# Altium project RbMotor_ECAT_RevB+.PrjPcb (part 2 of 2)

## Sheet 11.Current sampling.SchDoc
size 297 x 209 mm
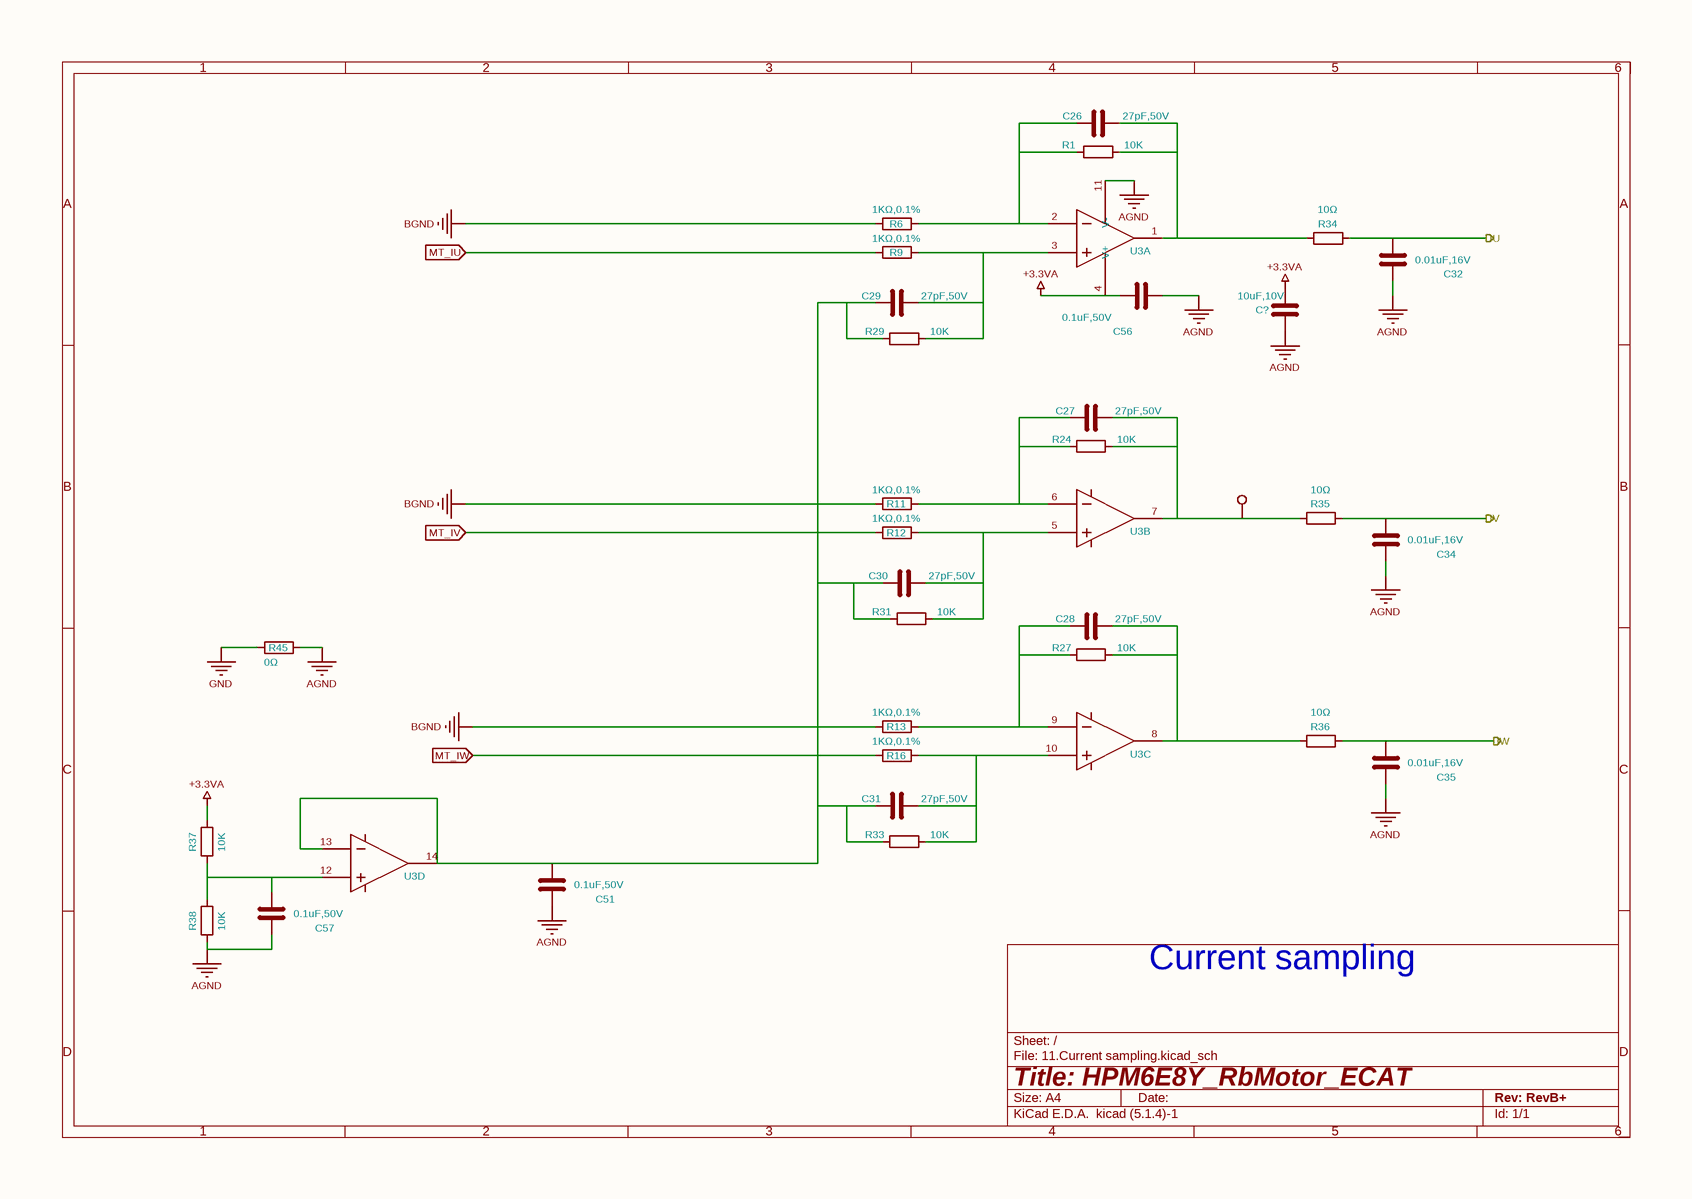
[diagram p12: 11.Current sampling.SchDoc]

### Parts
(Parts that share a designator on the sheet are numbered #1, #2 ... from top to bottom, then left to right.)
C26#2  27pF,50V  [C_0402]
C27  27pF,50V  [C_0402]
C28  27pF,50V  [C_0402]
C29  27pF,50V  [C_0402]
C30  27pF,50V  [C_0402]
C31  27pF,50V  [C_0402]
C32  0.01uF,16V  [C_0402_1005Metric]
C34  0.01uF,16V  [C_0402_1005Metric]
C35  0.01uF,16V  [C_0402_1005Metric]
C51  0.1uF,50V  [C_0402_1005Metric]
C56  0.1uF,50V  [C_0402_1005Metric]
C57  0.1uF,50V  [C_0402_1005Metric]
C?#9  10uF,10V  [C_0402]
R1  10K  [R_0402_1005Metric]
R6  1KΩ,0.1%  [R_0402_1005Metric]
R9  1KΩ,0.1%  [R_0402_1005Metric]
R11  1KΩ,0.1%  [R_0402_1005Metric]
R12  1KΩ,0.1%  [R_0402_1005Metric]
R13  1KΩ,0.1%  [R_0402_1005Metric]
R16  1KΩ,0.1%  [R_0402_1005Metric]
R24  10K  [R_0402_1005Metric]
R27  10K  [R_0402_1005Metric]
R29  10K  [R_0402_1005Metric]
R31  10K  [R_0402_1005Metric]
R33  10K  [R_0402_1005Metric]
R34  10Ω  [R_0402_1005Metric]
R35  10Ω  [R_0402_1005Metric]
R36  10Ω  [R_0402_1005Metric]
R37  10K  [R_0402_1005Metric]
R38  10K  [R_0402_1005Metric]
R45  0Ω  [R_0603_1608Metric]
TP14  0.5mm  [TestPoint_Pad_D0.5mm]  (value not drawn)
U3  TP2274-SR  [SOIC-14_L8.7-W3.9]  (value not drawn)  (parts A,B,C,D of 4)

### Ports
IU (out), IV (out), IW (out), MT_IU (in), MT_IV (in), MT_IW (in)

### Nets
+3.3VA: C56.2 C?#9.2 R37.2 U3.4(V+)
AGND: C32.2 C34.2 C35.2 C51.2 C56.1 C57.2 C?#9.1 R38.1 R45.1 U3.11(V-)
BGND: R6.1 R11.1 R13.1
GND: R45.2
IU: C32.1 R34.2 ; port IU
IV: C34.1 R35.2 ; port IV
IW: C35.1 R36.2 ; port IW
MT_IU: R9.1 ; port MT_IU
MT_IV: R12.1 ; port MT_IV
MT_IW: R16.1 ; port MT_IW
NetC26#2_1: C26#2.1 R1.1 R6.2 U3.2
NetC26#2_2: C26#2.2 R1.2 R34.1 U3.1
NetC27_1: C27.1 R11.2 R24.1 U3.6
NetC27_2: C27.2 R24.2 R35.1 TP14.1 U3.7
NetC28_1: C28.1 R13.2 R27.1 U3.9
NetC28_2: C28.2 R27.2 R36.1 U3.8
NetC29_1: C29.1 C30.1 C31.1 C51.1 R29.1 R31.1 R33.1 U3.13 U3.14
NetC29_2: C29.2 R9.2 R29.2 U3.3
NetC30_2: C30.2 R12.2 R31.2 U3.5
NetC31_2: C31.2 R16.2 R33.2 U3.10
NetC57_1: C57.1 R37.1 R38.2 U3.12

### Notes on the sheet
- Current sampling
- 1
- 2
- 3
- 4
- 5
- 6
- A
- B
- C
- D
- Title: HPM6E8Y_RbMotor_ECAT
- File: 11.Current sampling.kicad_sch
- Sheet: /
- KiCad E.D.A.  kicad (5.1.4)-1
- Size: A4
- Date:
- Rev: RevB+
- Id: 1/1

### Library data of the parts
C26#2 C27-C31 = 27pF,50V_0402: Model: 0402CG270J500NT; Company: FH(风华); Value: 27pF,50V; Footprint: 03_HPM_Capacitance:C_0402
C32 C34 C35 = 10nF,16V_0402: Model: CC0402KRX7R7BB103; Company: YAGEO(国巨); Value: 0.01uF,16V; Footprint: 03_HPM_Capacitance:C_0402_1005Metric
C51 C56 C57 = 0.1uF,50V_0402: Model: 0402B104K500NT; Company: SAMSUNG(三星); Value: 0.1uF,50V; Footprint: 03_HPM_Capacitance:C_0402_1005Metric
C?#9 = 10uF,10V_0402: as C9 on sheet 08.MCU_OSC; Value: 10uF,10V; Footprint: 03_HPM_Capacitance:C_0402
R1 R24 R27 R29 R31 R33 R37 R38 = 10K_0402: Model: 0402WGF1002TCE; Company: UNI-ROYAL(厚声); Value: 10K; Footprint: 02_HPM_Resistor:R_0402_1005Metric
R6 R9 R11-R13 R16 = 1K_0402: Company: UNI-ROYAL(厚声); Value: 1KΩ,0.1%; Footprint: 02_HPM_Resistor:R_0402_1005Metric
R34-R36 = 10Ω_0402: Model: 0402WGF100JTCE; Company: UNI-ROYAL(厚声); Value: 10Ω; Footprint: 02_HPM_Resistor:R_0402_1005Metric
R45 = 0Ω_0603: Model: 0603WAF0000T5E; Company: UNI-ROYAL(厚声); Value: 0Ω; Footprint: 02_HPM_Resistor:R_0603_1608Metric
TP14 = TestPoint-0.5mm: Value: 0.5mm; Footprint: 01_HPM_Peripheral:TestPoint_Pad_D0.5mm
U3 = TP2274-SR: Company: 3PEAK(思瑞浦); Model: TP2274-SR; Value: TP2274-SR; Footprint: 13_ower:SOIC-14_L8.7-W3.9

## Sheet 03.MCU_PA_JTAG.SchDoc
size 297 x 209 mm
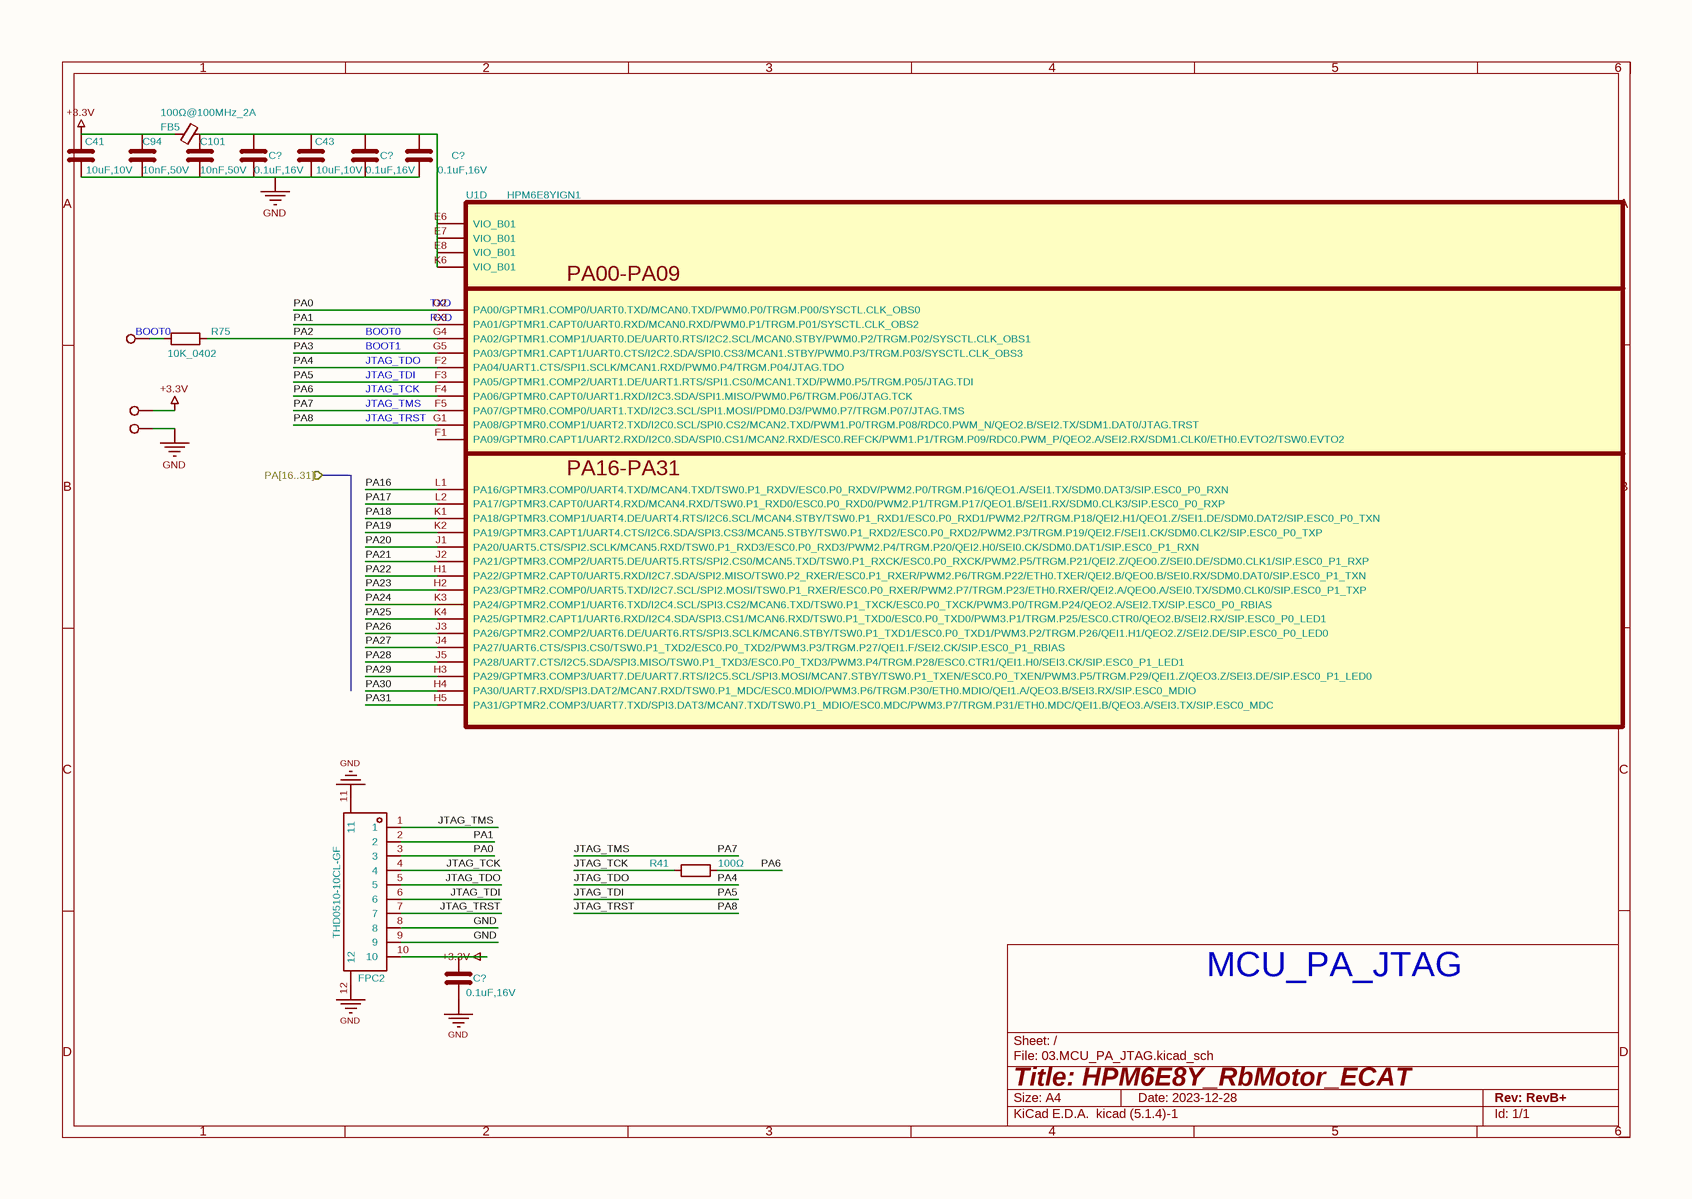
[diagram p13: 03.MCU_PA_JTAG.SchDoc]

### Parts
(Parts that share a designator on the sheet are numbered #1, #2 ... from top to bottom, then left to right.)
C41  10uF,10V  [C_0603_1608Metric]
C43  10uF,10V  [C_0603_1608Metric]
C94  10nF,50V  [C_0402_1005Metric]
C101  10nF,50V  [C_0402_1005Metric]
C?#10  0.1uF,16V  [C_0402]
C?#11  0.1uF,16V  [C_0402]
C?#12  0.1uF,16V  [C_0402]
C?#13  0.1uF,16V  [C_0402]
FB5  100Ω@100MHz_2A  [R_0603_1608Metric]
FPC2  THD0510-10CL-GF  [FPC_10P_0.5mm_JTAG]
R41  100Ω  [R_0402_1005Metric]
R75  10K_0402  [R_0402_1005Metric]
TP7  1.0mm  [TestPoint_1.5]  (value not drawn)
TP8  1.0mm  [TestPoint_1.5]  (value not drawn)
TP37  1.0mm  [TestPoint_1.5]  (value not drawn)
U1  HPM6E8YIGN1  [BGA-196_14x14_12.0x12.0mm_P0.8mm]  (part D of 10)

### Ports
PA[16..31] (in)

### Nets
+3.3V: C41.1 C94.1 C?#13.1 FB5.2 FPC2.10 TP8.1
GND: C41.2 C43.2 C94.2 C101.2 C?#10.2 C?#11.2 C?#12.2 C?#13.2 FPC2.8 FPC2.9 FPC2.11 FPC2.12 TP37.1
JTAG_TCK: FPC2.4 R41.1
JTAG_TDI: FPC2.6 U1.F3(PA05/GPTMR1.COMP2/UART1.DE/UART1.RTS/SPI1.CS0/MCAN1.TXD/PWM0.P5/TRGM.P05/JTAG.TDI)  [also labelled PA5]
JTAG_TDO: FPC2.5 U1.F2(PA04/UART1.CTS/SPI1.SCLK/MCAN1.RXD/PWM0.P4/TRGM.P04/JTAG.TDO)  [also labelled PA4]
JTAG_TMS: FPC2.1 U1.F5(PA07/GPTMR0.COMP0/UART1.TXD/I2C3.SCL/SPI1.MOSI/PDM0.D3/PWM0.P7/TRGM.P07/JTAG.TMS)  [also labelled PA7]
JTAG_TRST: FPC2.7 U1.G1(PA08/GPTMR0.COMP1/UART2.TXD/I2C0.SCL/SPI0.CS2/MCAN2.TXD/PWM1.P0/TRGM.P08/RDC0.PWM_N/QEO2.B/SEI2.TX/SDM1.DAT0/JTAG.TRST)  [also labelled PA8]
PA0: FPC2.3 U1.G2(PA00/GPTMR1.COMP0/UART0.TXD/MCAN0.TXD/PWM0.P0/TRGM.P00/SYSCTL.CLK_OBS0)
PA1: FPC2.2 U1.G3(PA01/GPTMR1.CAPT0/UART0.RXD/MCAN0.RXD/PWM0.P1/TRGM.P01/SYSCTL.CLK_OBS2)
PA2: R75.2 U1.G4(PA02/GPTMR1.COMP1/UART0.DE/UART0.RTS/I2C2.SCL/MCAN0.STBY/PWM0.P2/TRGM.P02/SYSCTL.CLK_OBS1)
PA3: U1.G5(PA03/GPTMR1.CAPT1/UART0.CTS/I2C2.SDA/SPI0.CS3/MCAN1.STBY/PWM0.P3/TRGM.P03/SYSCTL.CLK_OBS3)
PA6: R41.2 U1.F4(PA06/GPTMR0.CAPT0/UART1.RXD/I2C3.SDA/SPI1.MISO/PWM0.P6/TRGM.P06/JTAG.TCK)
PA16: U1.L1(PA16/GPTMR3.COMP0/UART4.TXD/MCAN4.TXD/TSW0.P1_RXDV/ESC0.P0_RXDV/PWM2.P0/TRGM.P16/QEO1.A/SEI1.TX/SDM0.DAT3/SIP.ESC0_P0_RXN)
PA17: U1.L2(PA17/GPTMR3.CAPT0/UART4.RXD/MCAN4.RXD/TSW0.P1_RXD0/ESC0.P0_RXD0/PWM2.P1/TRGM.P17/QEO1.B/SEI1.RX/SDM0.CLK3/SIP.ESC0_P0_RXP)
PA18: U1.K1(PA18/GPTMR3.COMP1/UART4.DE/UART4.RTS/I2C6.SCL/MCAN4.STBY/TSW0.P1_RXD1/ESC0.P0_RXD1/PWM2.P2/TRGM.P18/QEI2.H1/QEO1.Z/SEI1.DE/SDM0.DAT2/SIP.ESC0_P0_TXN)
PA19: U1.K2(PA19/GPTMR3.CAPT1/UART4.CTS/I2C6.SDA/SPI3.CS3/MCAN5.STBY/TSW0.P1_RXD2/ESC0.P0_RXD2/PWM2.P3/TRGM.P19/QEI2.F/SEI1.CK/SDM0.CLK2/SIP.ESC0_P0_TXP)
PA20: U1.J1(PA20/UART5.CTS/SPI2.SCLK/MCAN5.RXD/TSW0.P1_RXD3/ESC0.P0_RXD3/PWM2.P4/TRGM.P20/QEI2.H0/SEI0.CK/SDM0.DAT1/SIP.ESC0_P1_RXN)
PA21: U1.J2(PA21/GPTMR3.COMP2/UART5.DE/UART5.RTS/SPI2.CS0/MCAN5.TXD/TSW0.P1_RXCK/ESC0.P0_RXCK/PWM2.P5/TRGM.P21/QEI2.Z/QEO0.Z/SEI0.DE/SDM0.CLK1/SIP.ESC0_P1_RXP)
PA22: U1.H1(PA22/GPTMR2.CAPT0/UART5.RXD/I2C7.SDA/SPI2.MISO/TSW0.P2_RXER/ESC0.P1_RXER/PWM2.P6/TRGM.P22/ETH0.TXER/QEI2.B/QEO0.B/SEI0.RX/SDM0.DAT0/SIP.ESC0_P1_TXN)
PA23: U1.H2(PA23/GPTMR2.COMP0/UART5.TXD/I2C7.SCL/SPI2.MOSI/TSW0.P1_RXER/ESC0.P0_RXER/PWM2.P7/TRGM.P23/ETH0.RXER/QEI2.A/QEO0.A/SEI0.TX/SDM0.CLK0/SIP.ESC0_P1_TXP)
PA24: U1.K3(PA24/GPTMR2.COMP1/UART6.TXD/I2C4.SCL/SPI3.CS2/MCAN6.TXD/TSW0.P1_TXCK/ESC0.P0_TXCK/PWM3.P0/TRGM.P24/QEO2.A/SEI2.TX/SIP.ESC0_P0_RBIAS)
PA25: U1.K4(PA25/GPTMR2.CAPT1/UART6.RXD/I2C4.SDA/SPI3.CS1/MCAN6.RXD/TSW0.P1_TXD0/ESC0.P0_TXD0/PWM3.P1/TRGM.P25/ESC0.CTR0/QEO2.B/SEI2.RX/SIP.ESC0_P0_LED1)
PA26: U1.J3(PA26/GPTMR2.COMP2/UART6.DE/UART6.RTS/SPI3.SCLK/MCAN6.STBY/TSW0.P1_TXD1/ESC0.P0_TXD1/PWM3.P2/TRGM.P26/QEI1.H1/QEO2.Z/SEI2.DE/SIP.ESC0_P0_LED0)
PA27: U1.J4(PA27/UART6.CTS/SPI3.CS0/TSW0.P1_TXD2/ESC0.P0_TXD2/PWM3.P3/TRGM.P27/QEI1.F/SEI2.CK/SIP.ESC0_P1_RBIAS)
PA28: U1.J5(PA28/UART7.CTS/I2C5.SDA/SPI3.MISO/TSW0.P1_TXD3/ESC0.P0_TXD3/PWM3.P4/TRGM.P28/ESC0.CTR1/QEI1.H0/SEI3.CK/SIP.ESC0_P1_LED1)
PA29: U1.H3(PA29/GPTMR3.COMP3/UART7.DE/UART7.RTS/I2C5.SCL/SPI3.MOSI/MCAN7.STBY/TSW0.P1_TXEN/ESC0.P0_TXEN/PWM3.P5/TRGM.P29/QEI1.Z/QEO3.Z/SEI3.DE/SIP.ESC0_P1_LED0)
PA30: U1.H4(PA30/UART7.RXD/SPI3.DAT2/MCAN7.RXD/TSW0.P1_MDC/ESC0.MDIO/PWM3.P6/TRGM.P30/ETH0.MDIO/QEI1.A/QEO3.B/SEI3.RX/SIP.ESC0_MDIO)
PA31: U1.H5(PA31/GPTMR2.COMP3/UART7.TXD/SPI3.DAT3/MCAN7.TXD/TSW0.P1_MDIO/ESC0.MDC/PWM3.P7/TRGM.P31/ETH0.MDC/QEI1.B/QEO3.A/SEI3.TX/SIP.ESC0_MDC)
NetC43_1: C43.1 C101.1 C?#10.1 C?#11.1 C?#12.1 FB5.1 U1.E6(VIO_B01) U1.E7(VIO_B01) U1.E8(VIO_B01) U1.K6(VIO_B01)
NetR75_1: R75.1 TP7.1

Not connected (* = marked no-connect by the designer): U1 F1(PA09/GPTMR0.CAPT1/UART2.RXD/I2C0.SDA/SPI0.CS1/MCAN2.RXD/ESC0.REFCK/PWM1.P1/TRGM.P09/RDC0.PWM_P/QEO2.A/SEI2.RX/SDM1.CLK0/ETH0.EVTO2/TSW0.EVTO2)

### Notes on the sheet
- (near TP7) BOOT0
- BOOT1
- JTAG_TDO
- BOOT0
- (near U1) RXD
- (near U1) TXD
- (near U1) JTAG_TRST
- JTAG_TMS
- JTAG_TCK
- JTAG_TDI
- MCU_PA_JTAG
- 1
- 2
- 3
- 4
- 5
- 6
- A
- B
- C
- D
- Title: HPM6E8Y_RbMotor_ECAT
- File: 03.MCU_PA_JTAG.kicad_sch
- Sheet: /
- KiCad E.D.A.  kicad (5.1.4)-1
- Size: A4
- Date: 2023-12-28
- Rev: RevB+
- Id: 1/1
- (in symbol HPM6E8YIGN1, part D) PA00-PA09; PA16-PA31

### Library data of the parts
C41 C43 = 10uF,10V_0603: Model: CL10A106KP8NNNC; Company: SAMSUNG(三星); Value: 10uF,10V; Footprint: 03_HPM_Capacitance:C_0603_1608Metric
C94 C101 = 10nF,50V_0402: Model: CL05B103KB5NNNC; Company: SAMSUNG(三星); Value: 10nF,50V; Footprint: 03_HPM_Capacitance:C_0402_1005Metric
C?#10-C?#13 = 0.1uF,16V_0402: Model: CL05B104KO5NNNC; Company: SAMSUNG(三星); Value: 0.1uF,16V; Footprint: 03_HPM_Capacitance:C_0402
FB5 = 磁珠-100Ω@100MHz_2A_0603: Model: PZ1608D101-2R0TF; Company: Sunlord(顺络); Value: 100Ω@100MHz_2A; Footprint: 02_HPM_Resistor:R_0603_1608Metric
FPC2 = FPC_10P_0.5MM_JTAG: Company: THD(台华达); Model: THD0510-10CL-GF; Value: THD0510-10CL-GF; Footprint: 13_ower:FPC_10P_0.5mm_JTAG
R41 = 100Ω_0402: Model: 0402WGF1000TCE; Company: UNI-ROYAL(厚声); Value: 100Ω; Footprint: 02_HPM_Resistor:R_0402_1005Metric
R75 = 10K_0402: as R1 on sheet 11.Current sampling; Value: 10K_0402; Footprint: 02_HPM_Resistor:R_0402_1005Metric
TP7 TP8 TP37 = TestPoint-1.0mm: Value: 1.0mm; Footprint: 01_HPM_Peripheral:TestPoint_1.5
U1 = HPM6E8YIGN1: Value: HPM6E8YIGN1; Footprint: 00_HPM_Library:BGA-196_14x14_12.0x12.0mm_P0.8mm

## Sheet 06.MCU_PD.SchDoc
size 297 x 209 mm
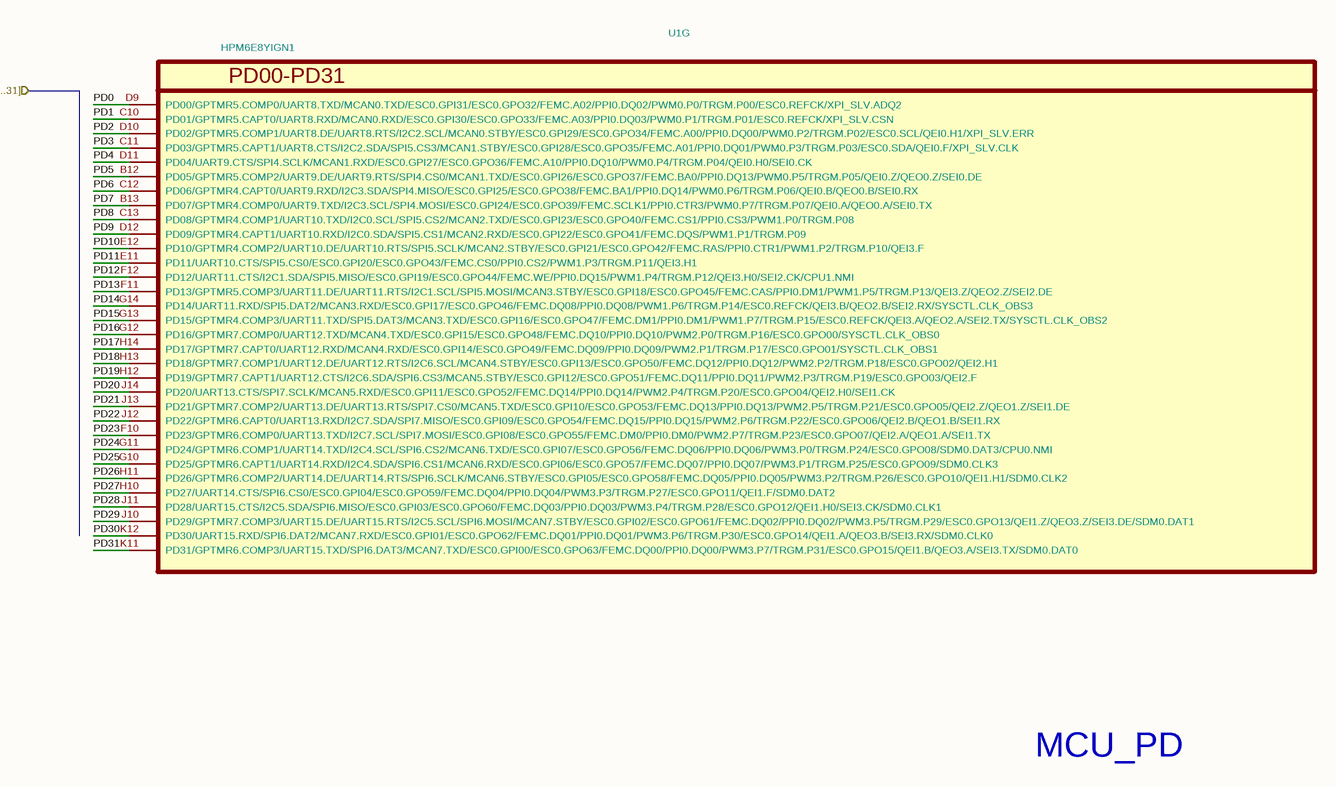
[diagram p14: 06.MCU_PD.SchDoc]

### Parts
U1  HPM6E8YIGN1  [BGA-196_14x14_12.0x12.0mm_P0.8mm]  (part G of 10)

### Ports
PD[0..31] (in)

### Nets
PD0: U1.D9(PD00/GPTMR5.COMP0/UART8.TXD/MCAN0.TXD/ESC0.GPI31/ESC0.GPO32/FEMC.A02/PPI0.DQ02/PWM0.P0/TRGM.P00/ESC0.REFCK/XPI_SLV.ADQ2)
PD1: U1.C10(PD01/GPTMR5.CAPT0/UART8.RXD/MCAN0.RXD/ESC0.GPI30/ESC0.GPO33/FEMC.A03/PPI0.DQ03/PWM0.P1/TRGM.P01/ESC0.REFCK/XPI_SLV.CSN)
PD2: U1.D10(PD02/GPTMR5.COMP1/UART8.DE/UART8.RTS/I2C2.SCL/MCAN0.STBY/ESC0.GPI29/ESC0.GPO34/FEMC.A00/PPI0.DQ00/PWM0.P2/TRGM.P02/ESC0.SCL/QEI0.H1/XPI_SLV.ERR)
PD3: U1.C11(PD03/GPTMR5.CAPT1/UART8.CTS/I2C2.SDA/SPI5.CS3/MCAN1.STBY/ESC0.GPI28/ESC0.GPO35/FEMC.A01/PPI0.DQ01/PWM0.P3/TRGM.P03/ESC0.SDA/QEI0.F/XPI_SLV.CLK)
PD4: U1.D11(PD04/UART9.CTS/SPI4.SCLK/MCAN1.RXD/ESC0.GPI27/ESC0.GPO36/FEMC.A10/PPI0.DQ10/PWM0.P4/TRGM.P04/QEI0.H0/SEI0.CK)
PD5: U1.B12(PD05/GPTMR5.COMP2/UART9.DE/UART9.RTS/SPI4.CS0/MCAN1.TXD/ESC0.GPI26/ESC0.GPO37/FEMC.BA0/PPI0.DQ13/PWM0.P5/TRGM.P05/QEI0.Z/QEO0.Z/SEI0.DE)
PD6: U1.C12(PD06/GPTMR4.CAPT0/UART9.RXD/I2C3.SDA/SPI4.MISO/ESC0.GPI25/ESC0.GPO38/FEMC.BA1/PPI0.DQ14/PWM0.P6/TRGM.P06/QEI0.B/QEO0.B/SEI0.RX)
PD7: U1.B13(PD07/GPTMR4.COMP0/UART9.TXD/I2C3.SCL/SPI4.MOSI/ESC0.GPI24/ESC0.GPO39/FEMC.SCLK1/PPI0.CTR3/PWM0.P7/TRGM.P07/QEI0.A/QEO0.A/SEI0.TX)
PD8: U1.C13(PD08/GPTMR4.COMP1/UART10.TXD/I2C0.SCL/SPI5.CS2/MCAN2.TXD/ESC0.GPI23/ESC0.GPO40/FEMC.CS1/PPI0.CS3/PWM1.P0/TRGM.P08)
PD9: U1.D12(PD09/GPTMR4.CAPT1/UART10.RXD/I2C0.SDA/SPI5.CS1/MCAN2.RXD/ESC0.GPI22/ESC0.GPO41/FEMC.DQS/PWM1.P1/TRGM.P09)
PD10: U1.E12(PD10/GPTMR4.COMP2/UART10.DE/UART10.RTS/SPI5.SCLK/MCAN2.STBY/ESC0.GPI21/ESC0.GPO42/FEMC.RAS/PPI0.CTR1/PWM1.P2/TRGM.P10/QEI3.F)
PD11: U1.E11(PD11/UART10.CTS/SPI5.CS0/ESC0.GPI20/ESC0.GPO43/FEMC.CS0/PPI0.CS2/PWM1.P3/TRGM.P11/QEI3.H1)
PD12: U1.F12(PD12/UART11.CTS/I2C1.SDA/SPI5.MISO/ESC0.GPI19/ESC0.GPO44/FEMC.WE/PPI0.DQ15/PWM1.P4/TRGM.P12/QEI3.H0/SEI2.CK/CPU1.NMI)
PD13: U1.F11(PD13/GPTMR5.COMP3/UART11.DE/UART11.RTS/I2C1.SCL/SPI5.MOSI/MCAN3.STBY/ESC0.GPI18/ESC0.GPO45/FEMC.CAS/PPI0.DM1/PWM1.P5/TRGM.P13/QEI3.Z/QEO2.Z/SEI2.DE)
PD14: U1.G14(PD14/UART11.RXD/SPI5.DAT2/MCAN3.RXD/ESC0.GPI17/ESC0.GPO46/FEMC.DQ08/PPI0.DQ08/PWM1.P6/TRGM.P14/ESC0.REFCK/QEI3.B/QEO2.B/SEI2.RX/SYSCTL.CLK_OBS3)
PD15: U1.G13(PD15/GPTMR4.COMP3/UART11.TXD/SPI5.DAT3/MCAN3.TXD/ESC0.GPI16/ESC0.GPO47/FEMC.DM1/PPI0.DM1/PWM1.P7/TRGM.P15/ESC0.REFCK/QEI3.A/QEO2.A/SEI2.TX/SYSCTL.CLK_OBS2)
PD16: U1.G12(PD16/GPTMR7.COMP0/UART12.TXD/MCAN4.TXD/ESC0.GPI15/ESC0.GPO48/FEMC.DQ10/PPI0.DQ10/PWM2.P0/TRGM.P16/ESC0.GPO00/SYSCTL.CLK_OBS0)
PD17: U1.H14(PD17/GPTMR7.CAPT0/UART12.RXD/MCAN4.RXD/ESC0.GPI14/ESC0.GPO49/FEMC.DQ09/PPI0.DQ09/PWM2.P1/TRGM.P17/ESC0.GPO01/SYSCTL.CLK_OBS1)
PD18: U1.H13(PD18/GPTMR7.COMP1/UART12.DE/UART12.RTS/I2C6.SCL/MCAN4.STBY/ESC0.GPI13/ESC0.GPO50/FEMC.DQ12/PPI0.DQ12/PWM2.P2/TRGM.P18/ESC0.GPO02/QEI2.H1)
PD19: U1.H12(PD19/GPTMR7.CAPT1/UART12.CTS/I2C6.SDA/SPI6.CS3/MCAN5.STBY/ESC0.GPI12/ESC0.GPO51/FEMC.DQ11/PPI0.DQ11/PWM2.P3/TRGM.P19/ESC0.GPO03/QEI2.F)
PD20: U1.J14(PD20/UART13.CTS/SPI7.SCLK/MCAN5.RXD/ESC0.GPI11/ESC0.GPO52/FEMC.DQ14/PPI0.DQ14/PWM2.P4/TRGM.P20/ESC0.GPO04/QEI2.H0/SEI1.CK)
PD21: U1.J13(PD21/GPTMR7.COMP2/UART13.DE/UART13.RTS/SPI7.CS0/MCAN5.TXD/ESC0.GPI10/ESC0.GPO53/FEMC.DQ13/PPI0.DQ13/PWM2.P5/TRGM.P21/ESC0.GPO05/QEI2.Z/QEO1.Z/SEI1.DE)
PD22: U1.J12(PD22/GPTMR6.CAPT0/UART13.RXD/I2C7.SDA/SPI7.MISO/ESC0.GPI09/ESC0.GPO54/FEMC.DQ15/PPI0.DQ15/PWM2.P6/TRGM.P22/ESC0.GPO06/QEI2.B/QEO1.B/SEI1.RX)
PD23: U1.F10(PD23/GPTMR6.COMP0/UART13.TXD/I2C7.SCL/SPI7.MOSI/ESC0.GPI08/ESC0.GPO55/FEMC.DM0/PPI0.DM0/PWM2.P7/TRGM.P23/ESC0.GPO07/QEI2.A/QEO1.A/SEI1.TX)
PD24: U1.G11(PD24/GPTMR6.COMP1/UART14.TXD/I2C4.SCL/SPI6.CS2/MCAN6.TXD/ESC0.GPI07/ESC0.GPO56/FEMC.DQ06/PPI0.DQ06/PWM3.P0/TRGM.P24/ESC0.GPO08/SDM0.DAT3/CPU0.NMI)
PD25: U1.G10(PD25/GPTMR6.CAPT1/UART14.RXD/I2C4.SDA/SPI6.CS1/MCAN6.RXD/ESC0.GPI06/ESC0.GPO57/FEMC.DQ07/PPI0.DQ07/PWM3.P1/TRGM.P25/ESC0.GPO09/SDM0.CLK3)
PD26: U1.H11(PD26/GPTMR6.COMP2/UART14.DE/UART14.RTS/SPI6.SCLK/MCAN6.STBY/ESC0.GPI05/ESC0.GPO58/FEMC.DQ05/PPI0.DQ05/PWM3.P2/TRGM.P26/ESC0.GPO10/QEI1.H1/SDM0.CLK2)
PD27: U1.H10(PD27/UART14.CTS/SPI6.CS0/ESC0.GPI04/ESC0.GPO59/FEMC.DQ04/PPI0.DQ04/PWM3.P3/TRGM.P27/ESC0.GPO11/QEI1.F/SDM0.DAT2)
PD28: U1.J11(PD28/UART15.CTS/I2C5.SDA/SPI6.MISO/ESC0.GPI03/ESC0.GPO60/FEMC.DQ03/PPI0.DQ03/PWM3.P4/TRGM.P28/ESC0.GPO12/QEI1.H0/SEI3.CK/SDM0.CLK1)
PD29: U1.J10(PD29/GPTMR7.COMP3/UART15.DE/UART15.RTS/I2C5.SCL/SPI6.MOSI/MCAN7.STBY/ESC0.GPI02/ESC0.GPO61/FEMC.DQ02/PPI0.DQ02/PWM3.P5/TRGM.P29/ESC0.GPO13/QEI1.Z/QEO3.Z/SEI3.DE/SDM0.DAT1)
PD30: U1.K12(PD30/UART15.RXD/SPI6.DAT2/MCAN7.RXD/ESC0.GPI01/ESC0.GPO62/FEMC.DQ01/PPI0.DQ01/PWM3.P6/TRGM.P30/ESC0.GPO14/QEI1.A/QEO3.B/SEI3.RX/SDM0.CLK0)
PD31: U1.K11(PD31/GPTMR6.COMP3/UART15.TXD/SPI6.DAT3/MCAN7.TXD/ESC0.GPI00/ESC0.GPO63/FEMC.DQ00/PPI0.DQ00/PWM3.P7/TRGM.P31/ESC0.GPO15/QEI1.B/QEO3.A/SEI3.TX/SDM0.DAT0)

### Notes on the sheet
- MCU_PD
- 1
- 2
- 3
- 4
- 5
- 6
- A
- B
- C
- D
- Title: HPM6E8Y_RbMotor_ECAT
- File: 06.MCU_PD.kicad_sch
- Sheet: /
- KiCad E.D.A.  kicad (5.1.4)-1
- Size: A4
- Date:
- Rev: RevB+
- Id: 1/1
- (in symbol HPM6E8YIGN1, part G) PD00-PD31

### Library data of the parts
U1 = HPM6E8YIGN1: Value: HPM6E8YIGN1; Footprint: 00_HPM_Library:BGA-196_14x14_12.0x12.0mm_P0.8mm

## Sheet 02.MCU_POWER.SchDoc
size 297 x 209 mm
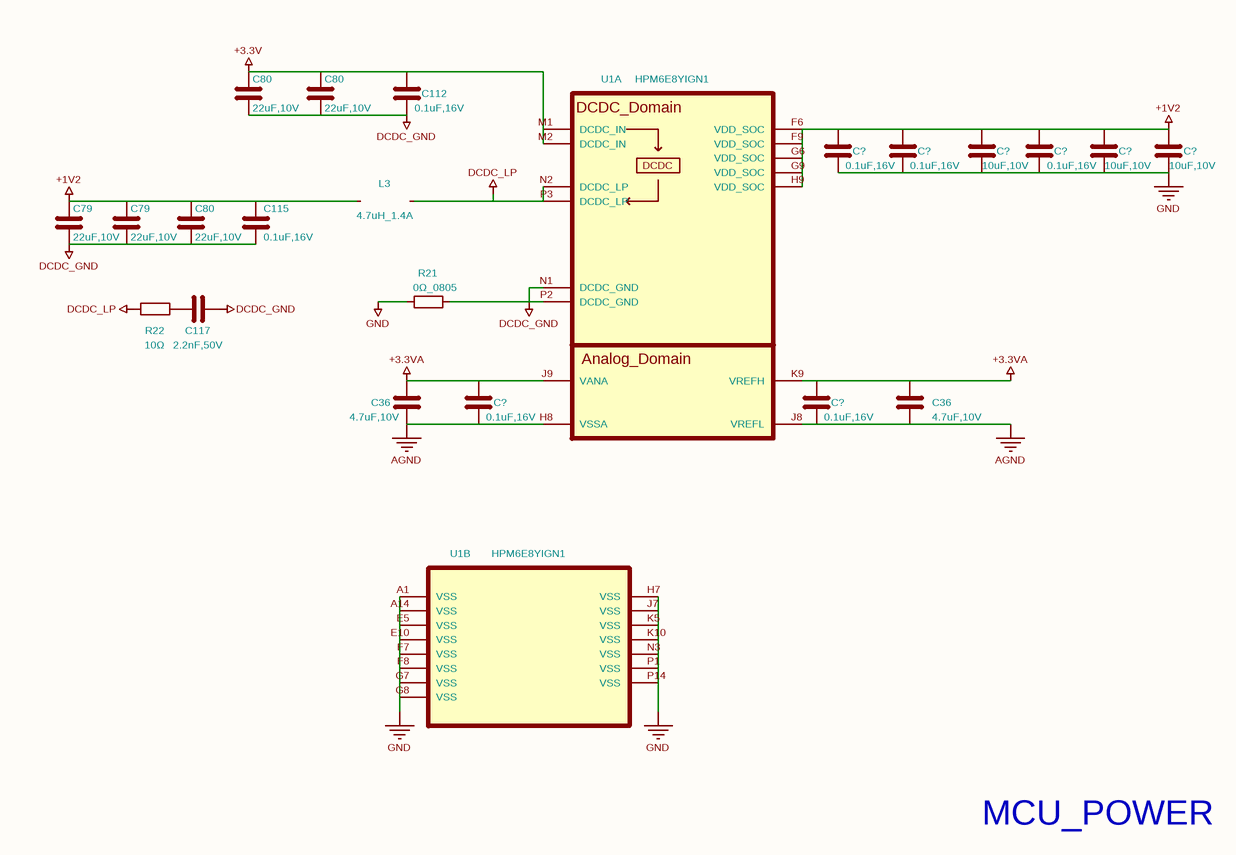
[diagram p15: 02.MCU_POWER.SchDoc]

### Parts
(Parts that share a designator on the sheet are numbered #1, #2 ... from top to bottom, then left to right.)
C36#2  4.7uF,10V  [C_0402]
C36#3  4.7uF,10V  [C_0402]
C79#2  22uF,10V  [C_0603_1608Metric]
C79#3  22uF,10V  [C_0603_1608Metric]
C80#2  22uF,10V  [C_0603_1608Metric]
C80#3  22uF,10V  [C_0603_1608Metric]
C80#4  22uF,10V  [C_0603_1608Metric]
C112  0.1uF,16V  [C_0402]
C115  0.1uF,16V  [C_0402]
C117  2.2nF,50V  [C_0402_1005Metric]
C?#14  0.1uF,16V  [C_0402]
C?#15  0.1uF,16V  [C_0402]
C?#16  10uF,10V  [C_0402]
C?#17  0.1uF,16V  [C_0402]
C?#18  10uF,10V  [C_0402]
C?#19  10uF,10V  [C_0402]
C?#20  0.1uF,16V  [C_0402]
C?#21  0.1uF,16V  [C_0402]
L3#2  4.7uH_1.4A  [L252010]
R21  0Ω_0805  [R_0805_2012Metric]
R22  10Ω  [R_0402_1005Metric]
U1  HPM6E8YIGN1  [BGA-196_14x14_12.0x12.0mm_P0.8mm]  (parts A,B of 10)

### Nets
+1V2: C79#2.1 C79#3.1 C80#4.1 C115.1 C?#14.1 C?#15.1 C?#16.1 C?#17.1 C?#18.1 C?#19.1 L3#2.1 U1.F6(VDD_SOC) U1.F9(VDD_SOC) U1.G6(VDD_SOC) U1.G9(VDD_SOC) U1.H9(VDD_SOC)
+3.3V: C80#2.1 C80#3.1 C112.1 U1.M1(DCDC_IN) U1.M2(DCDC_IN)
+3.3VA: C36#2.1 C36#3.1 C?#20.1 C?#21.1 U1.J9(VANA) U1.K9(VREFH)
AGND: C36#2.2 C36#3.2 C?#20.2 C?#21.2 U1.H8(VSSA) U1.J8(VREFL)
DCDC_GND: C79#2.2 C79#3.2 C80#2.2 C80#3.2 C80#4.2 C112.2 C115.2 C117.2 R21.2 U1.N1(DCDC_GND) U1.P2(DCDC_GND)
DCDC_LP: L3#2.2 R22.1 U1.N2(DCDC_LP) U1.P3(DCDC_LP)
GND: C?#14.2 C?#15.2 C?#16.2 C?#17.2 C?#18.2 C?#19.2 R21.1 U1.A1(VSS) U1.A14(VSS) U1.E5(VSS) U1.E10(VSS) U1.F7(VSS) U1.F8(VSS) U1.G7(VSS) U1.G8(VSS) U1.H7(VSS) U1.J7(VSS) U1.K5(VSS) U1.K10(VSS) U1.N3(VSS) U1.P1(VSS) U1.P14(VSS)
NetC117_1: C117.1 R22.2

### Notes on the sheet
- MCU_POWER
- 1
- 2
- 3
- 4
- 5
- 6
- A
- B
- C
- D
- Title: HPM6E8Y_RbMotor_ECAT
- File: 02.MCU_POWER.kicad_sch
- Sheet: /
- KiCad E.D.A.  kicad (5.1.4)-1
- Size: A4
- Date: 2023-12-28
- Rev: RevB+
- Id: 1/1
- (in symbol HPM6E8YIGN1, part A) DCDC_Domain; DCDC; Analog_Domain

### Library data of the parts
C36#2 C36#3 = 4.7uF,10V_0402: Model: CL05A475MP5NRNC; Company: SAMSUNG(三星); Value: 4.7uF,10V; Footprint: 03_HPM_Capacitance:C_0402
C79#2 C79#3 C80#2-C80#4 = 22uF,10V_0603: Model: CL10A226MP8NUNE; Company: SAMSUNG(三星); Value: 22uF,10V; Footprint: 03_HPM_Capacitance:C_0603_1608Metric
C112 = 0.1uF,16V_0402_6: Model: CL05B104KO5NNNC; Company: SAMSUNG(三星); Value: 0.1uF,16V; Footprint: 03_HPM_Capacitance:C_0402
C115 = 0.1uF,16V_0402_8: Model: CL05B104KO5NNNC; Company: SAMSUNG(三星); Value: 0.1uF,16V; Footprint: 03_HPM_Capacitance:C_0402
C117 = 2.2nF,50V_0402: Model: CL05B222KB5NNNC; Company: SAMSUNG(三星); Value: 2.2nF,50V; Footprint: 03_HPM_Capacitance:C_0402_1005Metric
C?#14 = 0.1uF,16V_0402_7: Model: CL05B104KO5NNNC; Company: SAMSUNG(三星); Value: 0.1uF,16V; Footprint: 03_HPM_Capacitance:C_0402
C?#15 = 0.1uF,16V_0402_17: Model: CL05B104KO5NNNC; Company: SAMSUNG(三星); Value: 0.1uF,16V; Footprint: 03_HPM_Capacitance:C_0402
C?#16 C?#18 C?#19 = 10uF,10V_0402: Model: CL05A106MP5NUNC; Company: SAMSUNG(三星); Value: 10uF,10V; Footprint: 03_HPM_Capacitance:C_0402
C?#17 = 0.1uF,16V_0402_5: Model: CL05B104KO5NNNC; Company: SAMSUNG(三星); Value: 0.1uF,16V; Footprint: 03_HPM_Capacitance:C_0402
C?#20 = 0.1uF,16V_0402_3: Model: CL05B104KO5NNNC; Company: SAMSUNG(三星); Value: 0.1uF,16V; Footprint: 03_HPM_Capacitance:C_0402
C?#21 = 0.1uF,16V_0402_1: Model: CL05B104KO5NNNC; Company: SAMSUNG(三星); Value: 0.1uF,16V; Footprint: 03_HPM_Capacitance:C_0402
L3#2 = 4.7uH_1.4A: Model: DFE252010F-4R7M; Company: muRata(村田); Value: 4.7uH_1.4A; Footprint: 07_HPM_Inductance:L252010
R21 = 0Ω_0805: Model: RS-05000JT; Company: FH(风华); Value: 0Ω_0805; Footprint: 02_HPM_Resistor:R_0805_2012Metric
R22 = 10Ω_0402: Model: 0402WGF100JTCE; Company: UNI-ROYAL(厚声); Value: 10Ω; Footprint: 02_HPM_Resistor:R_0402_1005Metric
U1 = HPM6E8YIGN1: Value: HPM6E8YIGN1; Footprint: 00_HPM_Library:BGA-196_14x14_12.0x12.0mm_P0.8mm

## Sheet 09.ECAT_IN_OUT.SchDoc
size 297 x 209 mm
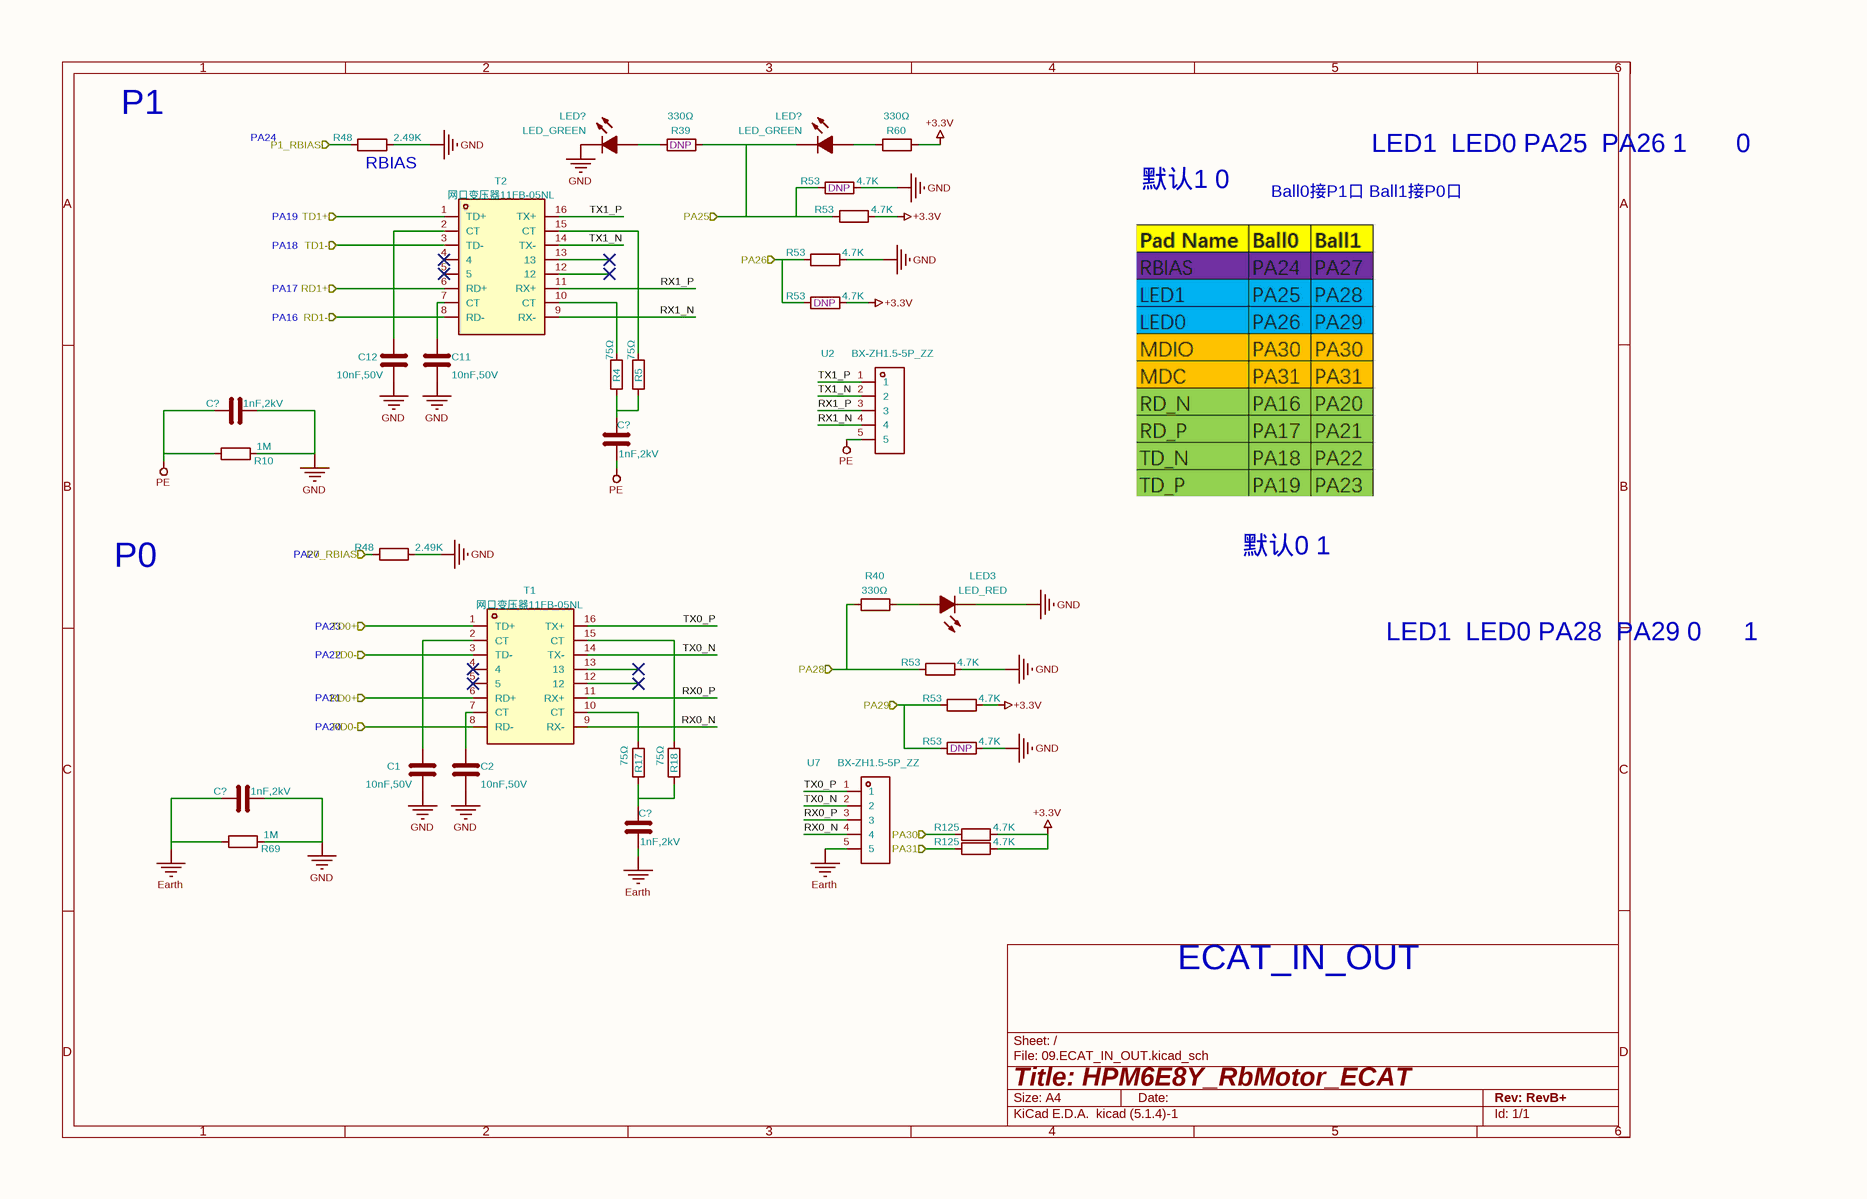
[diagram p16: 09.ECAT_IN_OUT.SchDoc]

### Parts
(Parts that share a designator on the sheet are numbered #1, #2 ... from top to bottom, then left to right.)
C1#2  10nF,50V  [C_0402]
C2#2  10nF,50V  [C_0402]
C11#2  10nF,50V  [C_0402]
C12#2  10nF,50V  [C_0402]
C?#22  1nF,2kV  [C_1206_3216Metric]
C?#23  1nF,2kV  [C_1206_3216Metric]
C?#24  1nF,2kV  [C_1206_3216Metric]
C?#25  1nF,2kV  [C_1206_3216Metric]
LED3  LED_RED  [LED_0603]
LED?#2  LED_GREEN  [LED_0603]
LED?#3  LED_GREEN  [LED_0603]
R4  75Ω  [R_0805_2012Metric]
R5  75Ω  [R_0805_2012Metric]
R10  1M  [R_1206_3216Metric]
R17  75Ω  [R_0805_2012Metric]
R18  75Ω  [R_0805_2012Metric]
R39  ASSY_OPT: DNP  [R_0402_1005Metric]  (hidden comment: 330Ω)
R40  330Ω  [R_0402_1005Metric]
R48#2  2.49K  [R_0402_1005Metric]
R48#3  2.49K  [R_0402_1005Metric]
R53#4  ASSY_OPT: DNP  [R_0402_1005Metric]  (hidden comment: 4.7K)
R53#5  4.7K  [R_0402_1005Metric]
R53#6  4.7K  [R_0402_1005Metric]
R53#7  ASSY_OPT: DNP  [R_0402_1005Metric]  (hidden comment: 4.7K)
R53#8  4.7K  [R_0402_1005Metric]
R53#9  4.7K  [R_0402_1005Metric]
R53#10  ASSY_OPT: DNP  [R_0402_1005Metric]  (hidden comment: 4.7K)
R60  330Ω  [R_0402_1005Metric]
R69  1M  [R_1206_3216Metric]
R125#1  4.7K  [R_0402_1005Metric]
R125#2  4.7K  [R_0402_1005Metric]
T1  网口变压器11FB-05NL  [H1102_XFMR16_SM]
T2  网口变压器11FB-05NL  [H1102_XFMR16_SM]
U2  BX-ZH1.5-5P_ZZ  [CONN-TH_ZH1.5-5A]
U7  BX-ZH1.5-5P_ZZ  [CONN-TH_ZH1.5-5A]

### Ports
P0_RBIAS (in), P1_RBIAS (in), PA25 (in), PA26 (in), PA28 (in), PA29 (in), PA30 (in), PA31 (in), RD0+ (in), RD0- (in), RD1+ (in), RD1- (in), TD0+ (in), TD0- (in), TD1+ (in), TD1- (in)

### Nets
+3.3V: R53#5.2 R53#7.2 R53#9.2 R60.2 R125#1.2 R125#2.2
Earth: C?#24.1 C?#25.2 R69.1 U7.5
GND: C1#2.1 C2#2.1 C11#2.1 C12#2.1 C?#22.2 C?#24.2 LED3.1(K) LED?#2.1(K) R10.2 R48#2.2 R48#3.2 R53#4.2 R53#6.2 R53#8.2 R53#10.2 R69.2
PE: C?#22.1 C?#23.2 R10.1 U2.5
P0_RBIAS: R48#3.1 ; port P0_RBIAS
P1_RBIAS: R48#2.1 ; port P1_RBIAS
PA25: LED?#3.1(K) R39.2 R53#4.1 R53#5.1 ; port PA25
PA26: R53#6.1 R53#7.1 ; port PA26
PA28: R40.2 R53#8.1 ; port PA28
PA29: R53#9.1 R53#10.1 ; port PA29
PA30: R125#1.1 ; port PA30
PA31: R125#2.1 ; port PA31
RD0+: T1.6(RD+) ; port RD0+
RD0-: T1.8(RD-) ; port RD0-
RD1+: T2.6(RD+) ; port RD1+
RD1-: T2.8(RD-) ; port RD1-
RX0_N: T1.9(RX-) U7.4
RX0_P: T1.11(RX+) U7.3
RX1_N: T2.9(RX-) U2.4
RX1_P: T2.11(RX+) U2.3
TD0+: T1.1(TD+) ; port TD0+
TD0-: T1.3(TD-) ; port TD0-
TD1+: T2.1(TD+) ; port TD1+
TD1-: T2.3(TD-) ; port TD1-
TX0_N: T1.14(TX-) U7.2
TX0_P: T1.16(TX+) U7.1
TX1_N: T2.14(TX-) U2.2
TX1_P: T2.16(TX+) U2.1
NetC1#2_2: C1#2.2 T1.2(CT)
NetC2#2_2: C2#2.2 T1.7(CT)
NetC11#2_2: C11#2.2 T2.7(CT)
NetC12#2_2: C12#2.2 T2.2(CT)
NetC?#23_1: C?#23.1 R4.1 R5.1
NetC?#25_1: C?#25.1 R17.1 R18.1
NetLED3_2: LED3.2(A) R40.1
NetLED?#2_2: LED?#2.2(A) R39.1
NetLED?#3_2: LED?#3.2(A) R60.1
NetR4_2: R4.2 T2.10(CT)
NetR5_2: R5.2 T2.15(CT)
NetR17_2: R17.2 T1.10(CT)
NetR18_2: R18.2 T1.15(CT)

Not connected (* = marked no-connect by the designer): T1 4* 5* 12* 13*; T2 4* 5* 12* 13*

### Notes on the sheet
- P1
- PA24
- PA19
- (near R48#2) RBIAS
- 默认1 0
- Ball0接P1口
  Ball1接P0口
- LED1  LED0
  PA25  PA26
  1       0
- PA18
- PA17
- PA16
- P0
- PA27
- 默认0 1
- PA23
- LED1  LED0
  PA28  PA29
  0      1
- PA21
- PA22
- PA20
- ECAT_IN_OUT
- 1
- 2
- 3
- 4
- 5
- 6
- A
- B
- C
- D
- Title: HPM6E8Y_RbMotor_ECAT
- File: 09.ECAT_IN_OUT.kicad_sch
- Sheet: /
- KiCad E.D.A.  kicad (5.1.4)-1
- Size: A4
- Date:
- Rev: RevB+
- Id: 1/1

### Library data of the parts
C1#2 C2#2 C11#2 C12#2 = 10nF,50V: Model: CL05B103KB5NNNC; Company: SAMSUNG(三星); Value: 10nF,50V; Footprint: 03_HPM_Capacitance:C_0402
C?#22-C?#25 = 1nF,2kV_1206: Model: CC1206KKX7RDBB102; Company: YAGEO(国巨); Value: 1nF,2kV; Footprint: 03_HPM_Capacitance:C_1206_3216Metric
LED3 = LED_RED: Model: NCD0603R1; Company: 国星光电; Value: LED_RED; Footprint: 01_HPM_Peripheral:LED_0603
LED?#2 LED?#3 = LED_GREEN: Model: NCD0603C1; Company: 国星光电; Value: LED_GREEN; Footprint: 01_HPM_Peripheral:LED_0603
R4 R5 R17 R18 = 75Ω_0805: Model: 0805W8F750JT5E; Company: UNI-ROYAL(厚声); Value: 75Ω; Footprint: 02_HPM_Resistor:R_0805_2012Metric
R10 R69 = 1M_1206: Model: ARG06BTC1004; Company: Viking(光颉); Value: 1M; Footprint: 02_HPM_Resistor:R_1206_3216Metric
R39 R40 R60 = 330Ω_0402: Model: 0402WGF3300TCE; Company: UNI-ROYAL(厚声); Value: 330Ω; Footprint: 02_HPM_Resistor:R_0402_1005Metric
R48#2 R48#3 = 2.49K_0402: Model: RC-02W2491FT; Company: FH(风华); Value: 2.49K; Footprint: 02_HPM_Resistor:R_0402_1005Metric
R53#4-R53#10 R125#1 R125#2 = 4.7K_0402: Model: 0402WGF4701TCE; Company: UNI-ROYAL(厚声); Value: 4.7K; Footprint: 02_HPM_Resistor:R_0402_1005Metric
T1 T2 = 网口变压器11FB-05NL: Company: YDS(元册科技); Model: 11FB-05NL; Value: 网口变压器11FB-05NL
U2 U7 = BX-ZH1.5-5P_ZZ: Model: BX-ZH1.5-5PZZ; Company: Bossie(博锡); Value: BX-ZH1.5-5P_ZZ; Footprint: 13_ower:CONN-TH_ZH1.5-5A

## Nets that join several sheets
+3.3V: 00. MAIN (R43.2), 08.MCU_OSC (7 pins), 10.AS5047 Encoder (5 pins), 01.SYS_POWER (FB?#2.1 LED?#1.2), 15.EEROM (5 pins), 05.MCU_PC (R68.1), 03.MCU_PA_JTAG (6 pins), 02.MCU_POWER (5 pins), 09.ECAT_IN_OUT (6 pins)
+3.3VA: 01.SYS_POWER (5 pins), 11.Current sampling (C56.2 C?#9.2 R37.2 U3.4), 02.MCU_POWER (6 pins)
+12V: 13.Motor DriverB (C54#1.1 R19#1.1 U5#1.1), 12.Motor DriverA (C54#2.1 R20.1 U5#2.1), 14.Motor DriverC (C54#3.1 R19#2.1 U5#3.1), 01.SYS_POWER (7 pins)
+24V: 13.Motor DriverB (C60#1.1 Q1#1.5), 12.Motor DriverA (C60#2.1 Q1#2.5 R79.2), 14.Motor DriverC (C60#3.1 Q1#3.5), 01.SYS_POWER (19 pins)
AGND: 11.Current sampling (10 pins), 02.MCU_POWER (6 pins)
BGND: 13.Motor DriverB (5 pins), 12.Motor DriverA (8 pins), 14.Motor DriverC (5 pins), 01.SYS_POWER (18 pins), 11.Current sampling (R6.1 R11.1 R13.1)
GND: 08.MCU_OSC (17 pins), 12.Motor DriverA (C107.2), 10.AS5047 Encoder (5 pins), 01.SYS_POWER (33 pins), 15.EEROM (8 pins), 11.Current sampling (R45.2), 03.MCU_PA_JTAG (13 pins), 02.MCU_POWER (22 pins), 09.ECAT_IN_OUT (16 pins)
MT_IU: 12.Motor DriverA (Q2#2.1 Q2#2.2 Q2#2.3 R55#2.2), 11.Current sampling (R9.1)
MT_IV: 13.Motor DriverB (Q2#1.1 Q2#1.2 Q2#1.3 R55#1.2), 11.Current sampling (R12.1)
MT_IW: 14.Motor DriverC (Q2#3.1 Q2#3.2 Q2#3.3 R55#3.2), 11.Current sampling (R16.1)